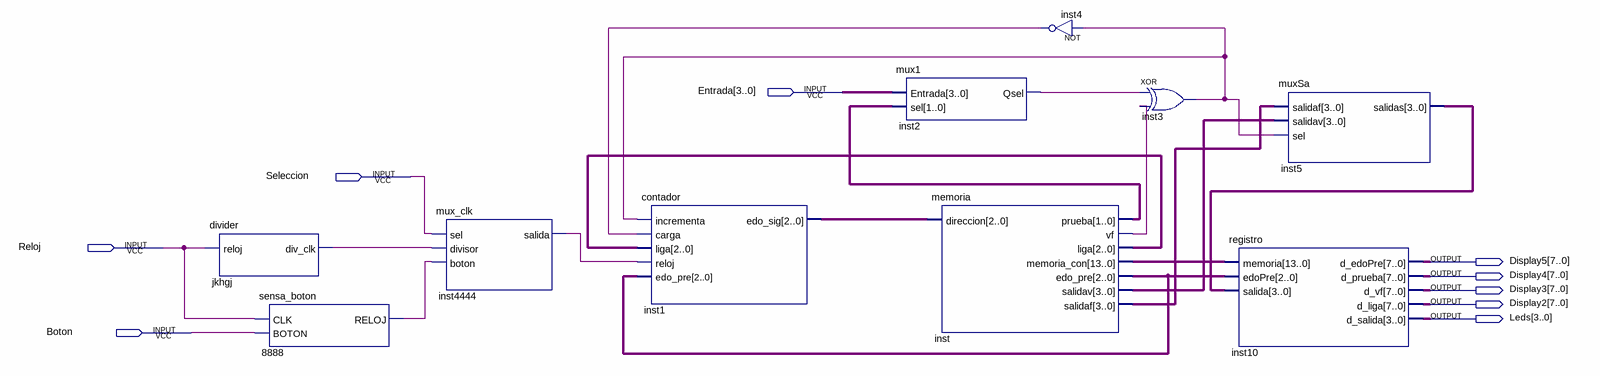
[diagram p0: schematic sheet]
// Quartus schematic practica5.bdf as structural Verilog: 10 symbols, 9 pins
module practica5 (
  input  [3:0] Entrada,
  input  Seleccion,
  input  Reloj,
  input  Boton,
  output [7:0] Display5,
  output [7:0] Display4,
  output [7:0] Display3,
  output [7:0] Display2,
  output [3:0] Leds
);

  wire inst2_qsel, inst3_out, inst4_out, inst4444_salida, inst_vf, jkhgj_div_clk, n8888_reloj;
  wire [1:0] inst_prueba;
  wire [2:0] inst1_edo_sig, inst_edo_pre, inst_liga;
  wire [3:0] inst5_salidas, inst_salidaf, inst_salidav;
  wire [13:0] inst_memoria_con;

  divider jkhgj (.reloj(Reloj), .div_clk(jkhgj_div_clk));
  sensa_boton u_8888 (.CLK(Reloj), .BOTON(Boton), .RELOJ(n8888_reloj));
  mux_clk inst4444 (.sel(Seleccion), .divisor(jkhgj_div_clk), .boton(n8888_reloj), .salida(inst4444_salida));
  contador inst1 (
    .incrementa(inst3_out), .carga(inst4_out), .liga(inst_liga), .reloj(inst4444_salida),
    .edo_pre(inst_edo_pre), .edo_sig(inst1_edo_sig));
  mux1 inst2 (.Entrada(Entrada), .sel(inst_prueba), .Qsel(inst2_qsel));
  memoria inst (
    .direccion(inst1_edo_sig), .prueba(inst_prueba), .vf(inst_vf), .liga(inst_liga),
    .memoria_con(inst_memoria_con), .edo_pre(inst_edo_pre), .salidav(inst_salidav), .salidaf(inst_salidaf));
  not inst4 (inst4_out, inst3_out);
  xor inst3 (inst3_out, inst2_qsel, inst_vf);
  registro inst10 (
    .memoria(inst_memoria_con), .edoPre(inst_edo_pre), .salida(inst5_salidas), .d_edoPre(Display5),
    .d_prueba(Display4), .d_vf(Display3), .d_liga(Display2), .d_salida(Leds));
  muxSa inst5 (.salidaf(inst_salidaf), .salidav(inst_salidav), .sel(inst3_out), .salidas(inst5_salidas));
endmodule
